# EAGLE schematic GPS Tracker v1.2 (EAGLE 6.4)
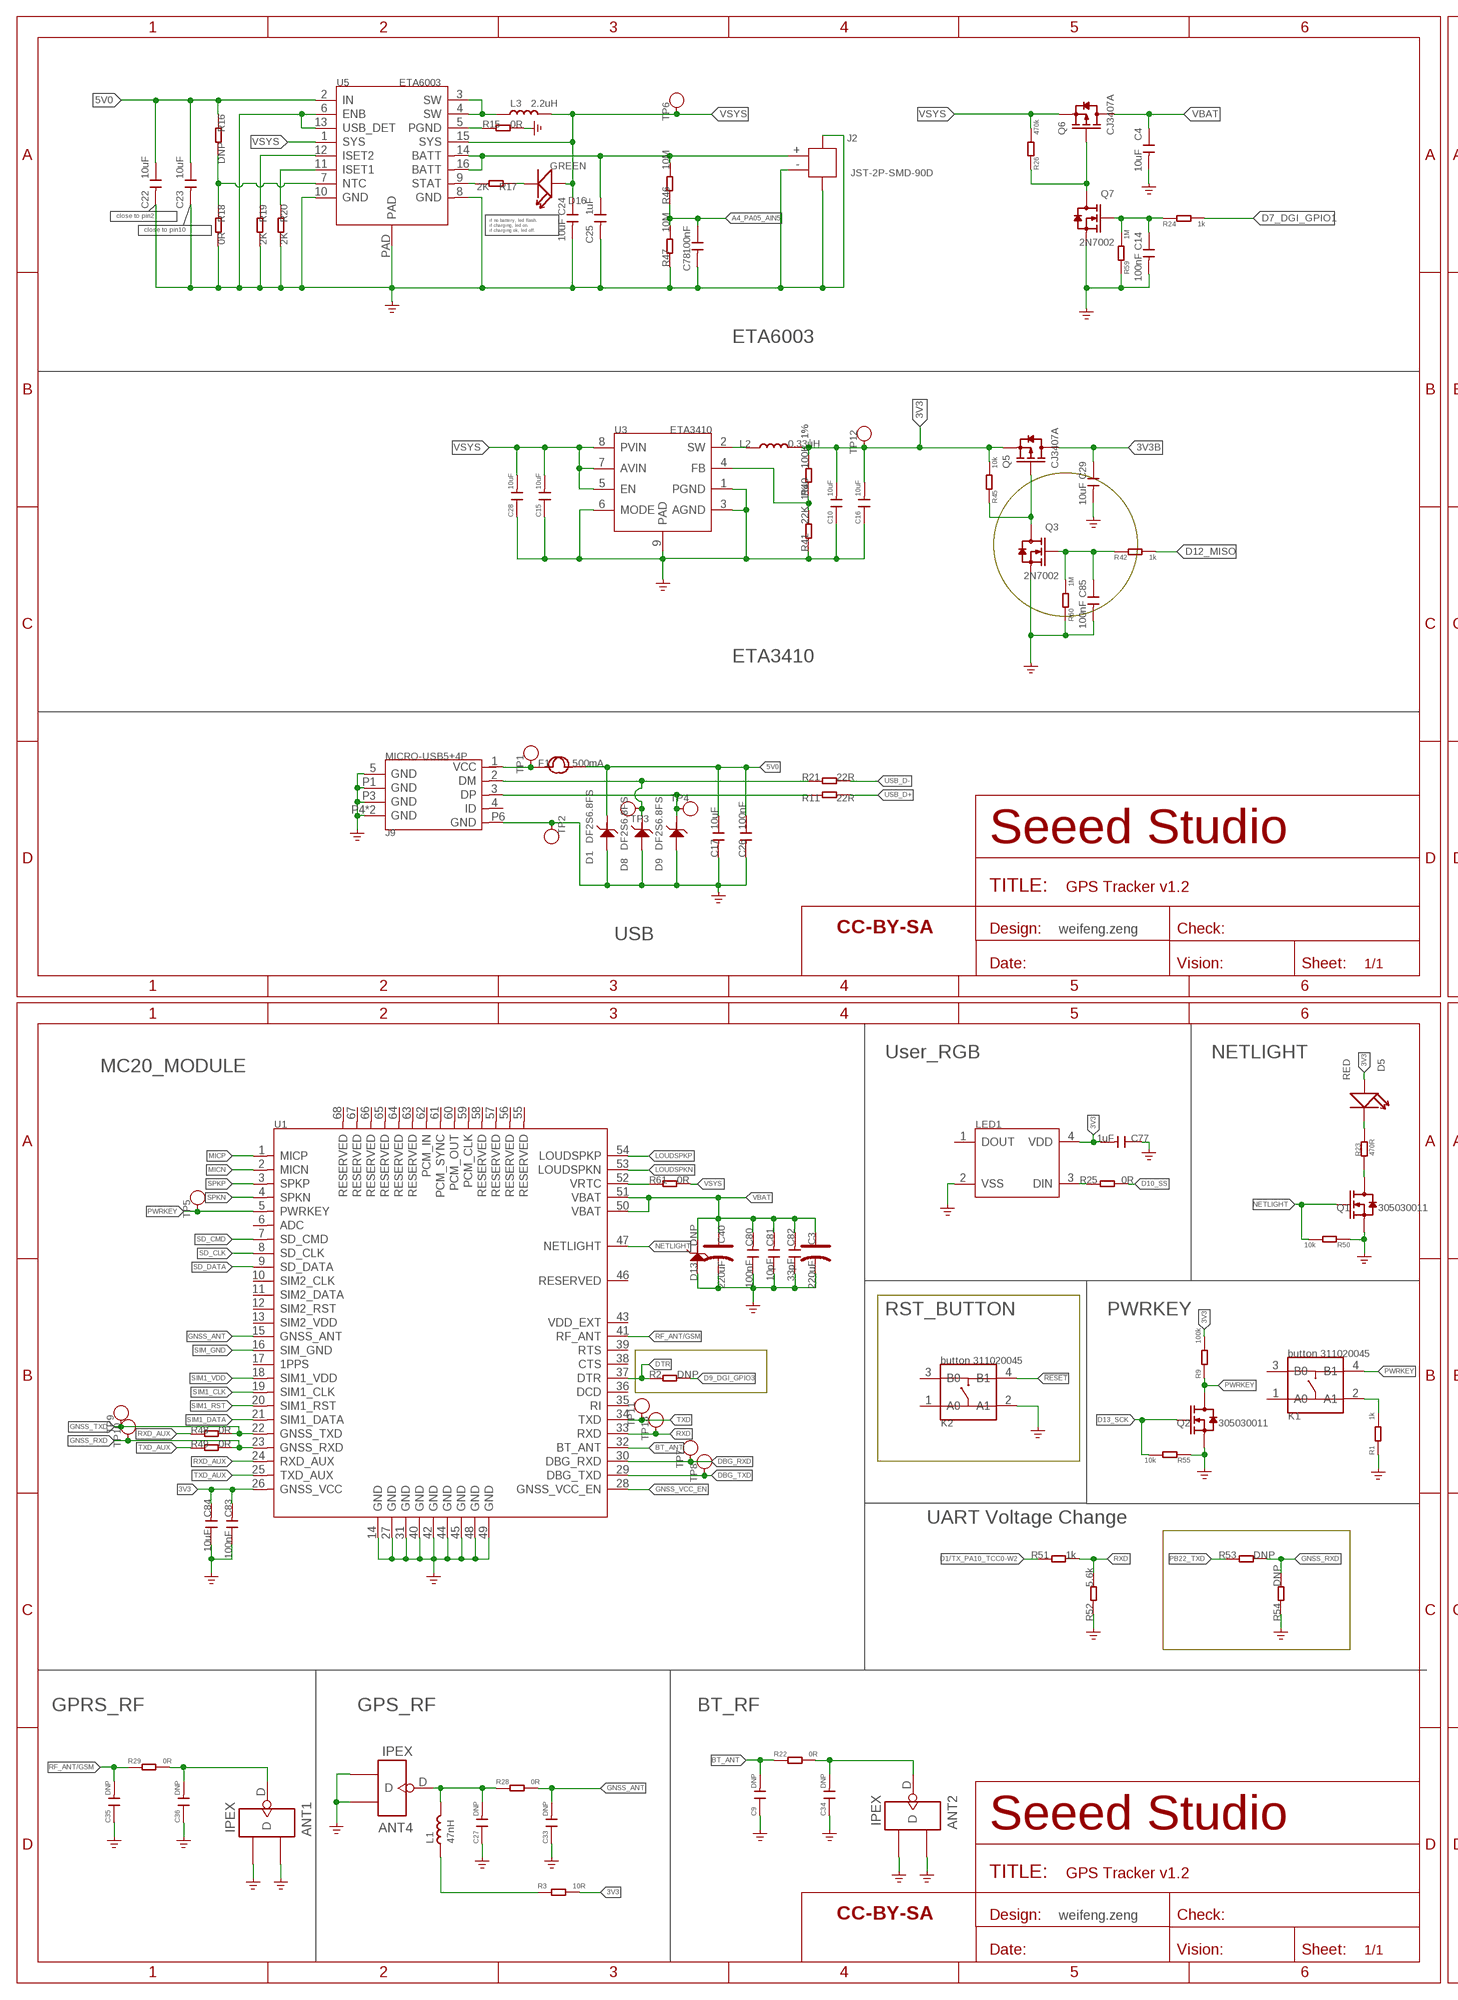
[diagram p0: schematic, sheet 1, part 1 of 2]
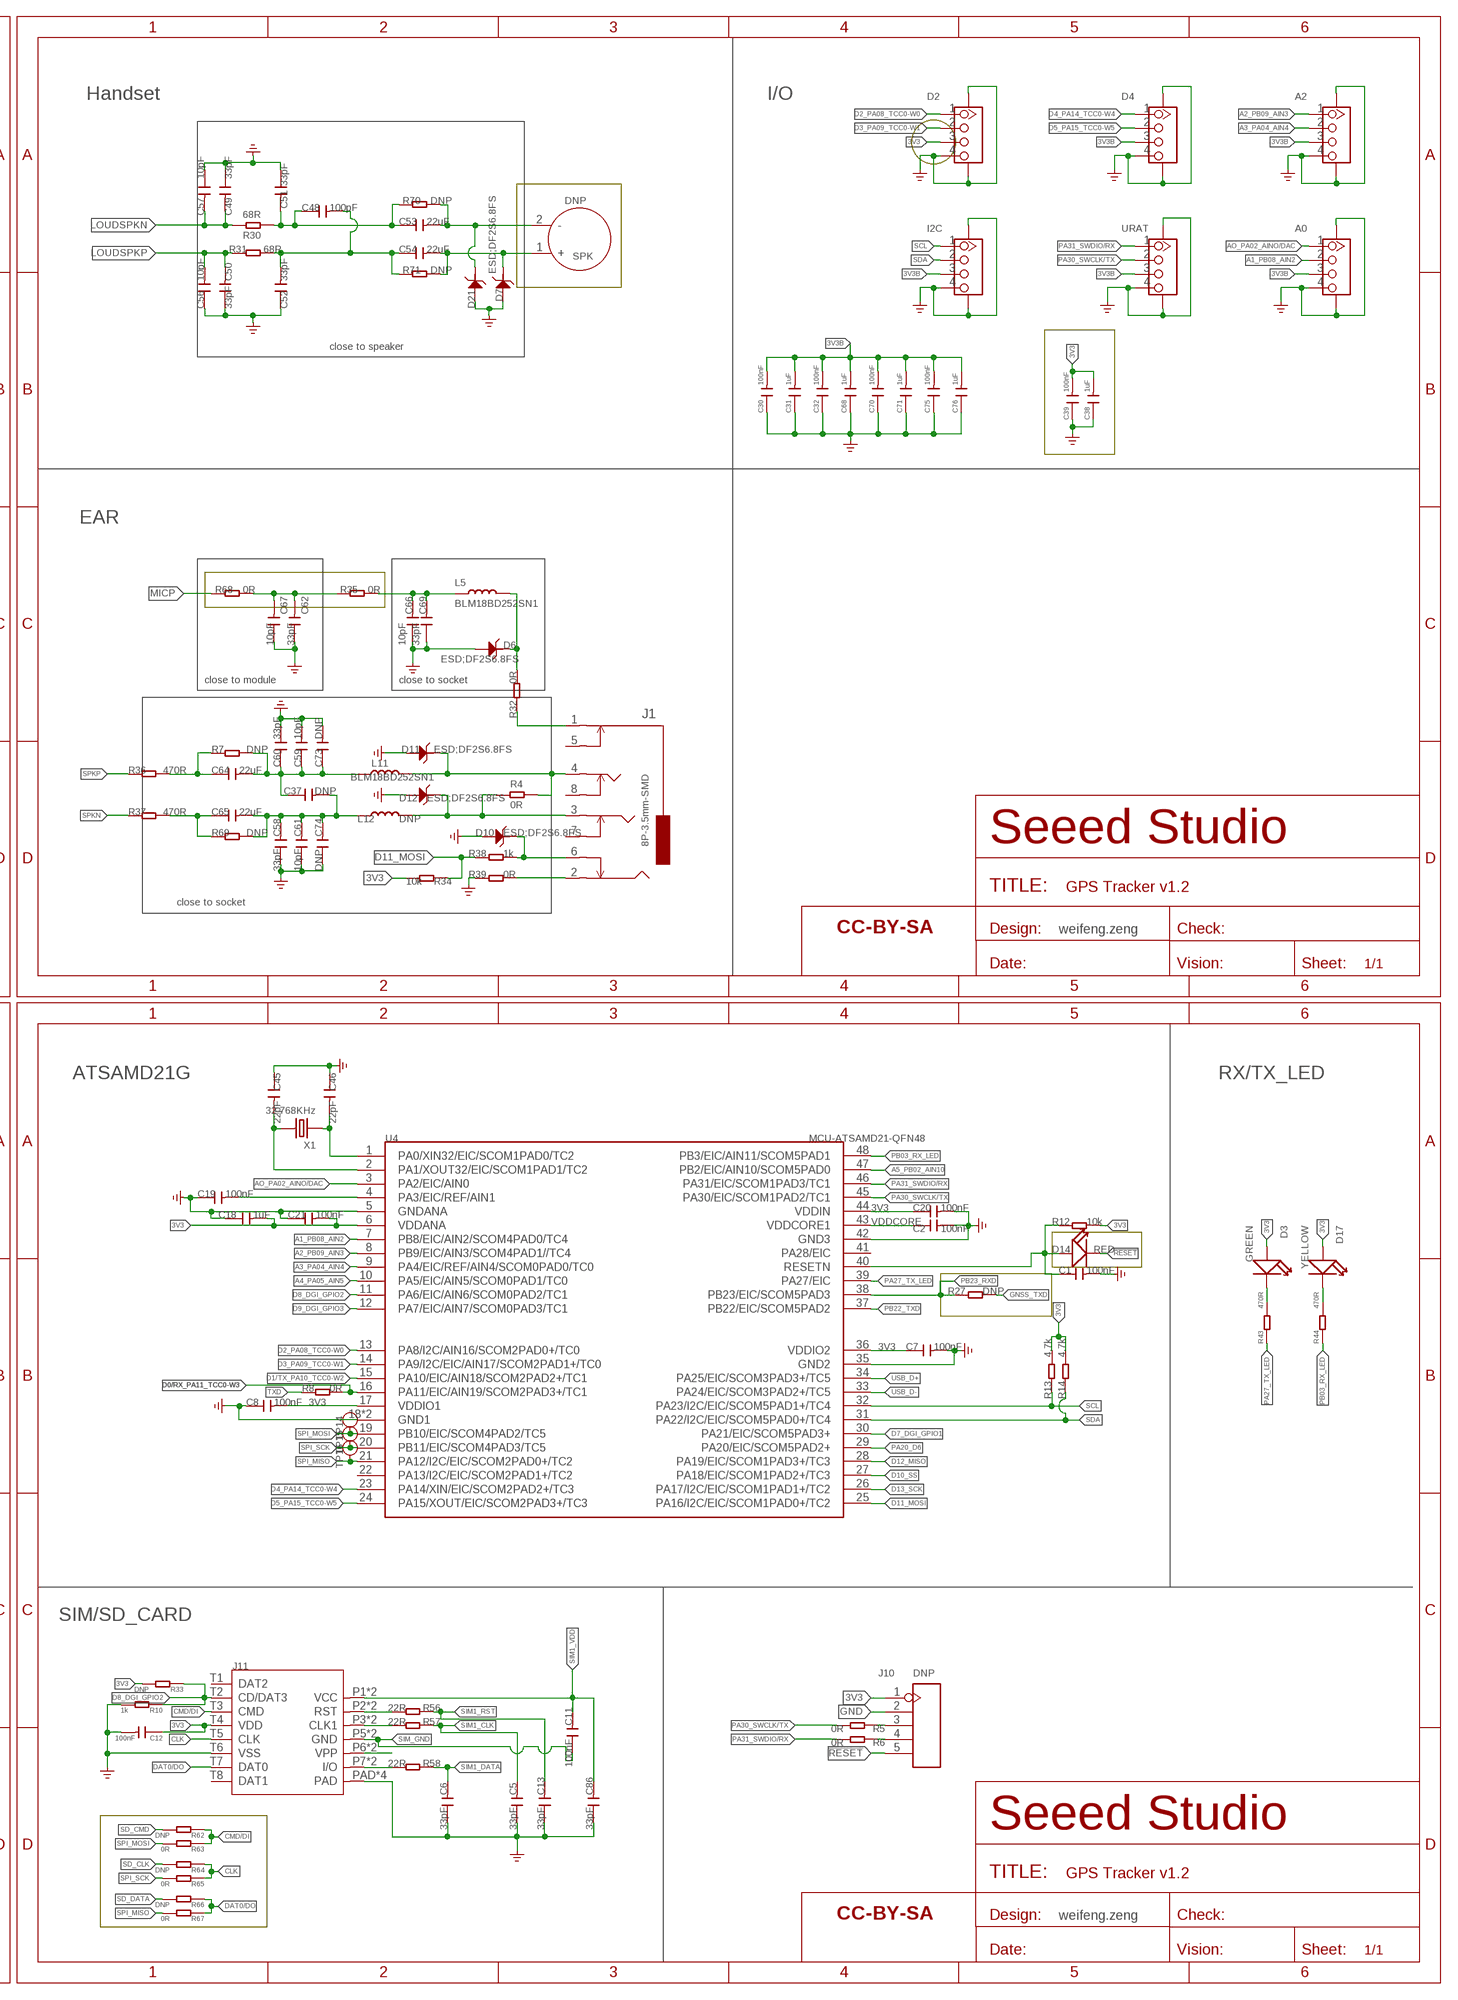
[diagram p1: schematic, sheet 1, part 2 of 2]

## Parts
A0  GROVE-CONNECTOR-SMD'90D'  [HW4-SMD-2.0-90D]
A2  GROVE-CONNECTOR-SMD'90D'  [HW4-SMD-2.0-90D]
ANT1  IPEX  ANTENNA-U-FL  [U-FL3P-SMD-2.6X2.6X1.0MM]
ANT2  IPEX  ANTENNA-U-FL  [U-FL3P-SMD-2.6X2.6X1.0MM]
ANT4  IPEX  ANTENNA-U-FL  [U-FL3P-SMD-2.6X2.6X1.0MM]
C1  100nF  C-0402  [C0402]
C2  100nF  C-0402  [C0402]
C3  220uF  CAP-POLAR-AVX-B  [AVX-B]
C4  10uF  C-0603  [C0603]
C5  33pF  C-0402  [C0402]
C6  33pF  C-0402  [C0402]
C7  100nF  C-0402  [C0402]
C8  100nF  C-0402  [C0402]
C9  DNP  C-0402  [C0402]
C10  10uF  C-0603  [C0603]
C11  100nF  C-0402  [C0402]
C12  100nF  C-0402  [C0402]
C13  33pF  C-0402  [C0402]
C14  100nF  C-0603  [C0603]
C15  10uF  C-0603  [C0603]
C16  10uF  C-0603  [C0603]
C17  10uF  C-0603  [C0603]
C18  1uF  C-0402  [C0402]
C19  100nF  C-0402  [C0402]
C20  100nF  C-0402  [C0402]
C21  100nF  C-0402  [C0402]
C22  10uF  C-0603  [C0603]
C23  10uF  C-0603  [C0603]
C24  10uF  C-0603  [C0603]
C25  1uF  C-0402  [C0402]
C26  100nF  C-0402  [C0402]
C27  DNP  C-0402  [C0402]
C28  10uF  C-0603  [C0603]
C29  10uF  C-0603  [C0603]
C30  100nF  C-0402  [C0402]
C31  1uF  C-0402  [C0402]
C32  100nF  C-0402  [C0402]
C33  DNP  C-0402  [C0402]
C34  DNP  C-0402  [C0402]
C35  DNP  C-0402  [C0402]
C36  DNP  C-0402  [C0402]
C37  DNP  C-0402  [C0402]
C38  1uF  C-0402  [C0402]
C39  100nF  C-0402  [C0402]
C40  220uF  CAP-POLAR-AVX-B  [AVX-B]
C45  22pF  C-0402  [C0402]
C46  22pF  C-0402  [C0402]
C48  100pF  C-0402  [C0402]
C49  33pF  C-0402  [C0402]
C50  33pF  C-0402  [C0402]
C51  33pF  C-0402  [C0402]
C52  33pF  C-0402  [C0402]
C53  22uF  CAP-0805  [C0805]
C54  22uF  CAP-0805  [C0805]
C56  10pF  C-0402  [C0402]
C57  10pF  C-0402  [C0402]
C58  33pF  C-0402  [C0402]
C59  10pF  C-0402  [C0402]
C60  33pF  C-0402  [C0402]
C61  10pF  C-0402  [C0402]
C62  33pF  C-0402  [C0402]
C64  22uF  CAP-0805  [C0805]
C65  22uF  CAP-0805  [C0805]
C66  10pF  C-0402  [C0402]
C67  10pF  C-0402  [C0402]
C68  1uF  C-0402  [C0402]
C69  33pF  C-0402  [C0402]
C70  100nF  C-0402  [C0402]
C71  1uF  C-0402  [C0402]
C73  DNP  C-0402  [C0402]
C74  DNP  C-0402  [C0402]
C75  100nF  C-0402  [C0402]
C76  1uF  C-0402  [C0402]
C77  1uF  C-0402  [C0402]
C78  100nF  C-0402  [C0402]
C80  100nF  C-0402  [C0402]
C81  10pF  C-0402  [C0402]
C82  33pF  C-0402  [C0402]
C83  100nF  C-0402  [C0402]
C84  10uF  C-0603  [C0603]
C85  100nF  C-0603  [C0603]
C86  33pF  C-0402  [C0402]
D1  DF2S6.8FS  D-ESD-2P'DF2S6.8FS'  [SOD-923]
D2  GROVE-CONNECTOR-SMD'90D'  [HW4-SMD-2.0-90D]
D3  GREEN  LED-0402  [LED-0402]
D4  GROVE-CONNECTOR-SMD'90D'  [HW4-SMD-2.0-90D]
D5  RED  LED-0402  [LED-0402]
D6  ESD;DF2S6.8FS  D-ESD-2P'DF2S6.8FS'  [SOD-923]
D7  ESD;DF2S6.8FS  D-ESD-2P'DF2S6.8FS'  [SOD-923]
D8  DF2S6.8FS  D-ESD-2P'DF2S6.8FS'  [SOD-923]
D9  DF2S6.8FS  D-ESD-2P'DF2S6.8FS'  [SOD-923]
D10  ESD;DF2S6.8FS  D-ESD-2P'DF2S6.8FS'  [SOD-923]
D11  ESD;DF2S6.8FS  D-ESD-2P'DF2S6.8FS'  [SOD-923]
D12  ESD;DF2S6.8FS  D-ESD-2P'DF2S6.8FS'  [SOD-923]
D13  DNP  D-ESD-2P'DF2S6.8FS'  [SOD-923]
D14  RED  LED-0402  [LED-0402]
D16  GREEN  LED-0402  [LED-0402]
D17  YELLOW  LED-0402  [LED-0402]
D21  ESD;DF2S6.8FS  D-ESD-2P'DF2S6.8FS'  [SOD-923]
F1  500mA  FUSE'1206'  [F1206]
FR1  SEEEDSTUDIO-OPEN-SCH-FRAME  [SEEEDSTUDIO-PCB-FRAME]
FR2  SEEEDSTUDIO-OPEN-SCH-FRAME  [SEEEDSTUDIO-PCB-FRAME]
FR3  SEEEDSTUDIO-OPEN-SCH-FRAME  [SEEEDSTUDIO-PCB-FRAME]
FR4  SEEEDSTUDIO-OPEN-SCH-FRAME  [SEEEDSTUDIO-PCB-FRAME]
I2C  GROVE-CONNECTOR-SMD'90D'  [HW4-SMD-2.0-90D]
J1  8P-3.5mm-SMD  AUDIO-8P'PJ-3536-L6S'  [8P-3.5-SMD]
J2  JST-2P-SMD-90D  JST-2P-SMD'1.0'  [HW2-SMD-1.0-90D]
J9  MICRO-USB5+4P  [MICRO-USB5+5P-SMD-0.65-7.2X5.06MM]
J10  DNP  HEADER-5P-TEST  [H5-SMD-2.0-TEST]
J11  NANO_SIM+TF-24P  [SIM+TF-24P-SMD-1.2-15.05X13.66X2.5MM]
K1  button 311020045  BUTTON-4P-4.5X3.2  [SW4P-SMD-4.5X3.2X2.5MM]
K2  button 311020045  BUTTON-4P-4.5X3.2  [SW4P-SMD-4.5X3.2X2.5MM]
L1  47nH  INDUCTOR/FERRITE-BEAD'0402'  [L0402]
L2  0.33uH  L-MPM201610SR33_T  [L201610]
L3  2.2uH  INDUCTOR/FERRITE-BEAD'0805'  [L0805]
L5  BLM18BD252SN1  L'0603'  [L0603]
L11  BLM18BD252SN1  L'0603'  [L0603]
L12  DNP  L'0603'  [L0603]
LED1  LED-RGB-4P-SK6812-SK6812  [LED4-1.75-3.7X3.5X0.95MM]
Q1  305030011  MOSFET-N+'SI1304BDL'  [SOT-323]
Q2  305030011  MOSFET-N+'SI1304BDL'  [SOT-323]
Q3  2N7002  MOSFET-N+'SOT23'  [SOT-23]
Q5  CJ3407A  MOSFET-P'SI2323CDS/SI2305DS<BR>'  [SOT-23]
Q6  CJ3407A  MOSFET-P'SI2323CDS/SI2305DS<BR>'  [SOT-23]
Q7  2N7002  MOSFET-N+'SOT23'  [SOT-23]
R1  1k  R-0402  [R0402]
R2  DNP  R-0402  [R0402]
R3  10R  R-0402  [R0402]
R4  0R  R-0402  [R0402]
R5  0R  R-0402  [R0402]
R6  0R  R-0402  [R0402]
R7  DNP  R-0402  [R0402]
R8  0R  R-0402  [R0402]
R9  100k  R-0402  [R0402]
R10  1k  R-0402  [R0402]
R11  22R  R-0402  [R0402]
R12  10k  R-0402  [R0402]
R13  4.7k  R-0402  [R0402]
R14  4.7k  R-0402  [R0402]
R15  0R  R-0402  [R0402]
R16  DNP  R-0402  [R0402]
R17  2K  R-0402  [R0402]
R18  0R  R-0402  [R0402]
R19  2K  R-0402  [R0402]
R20  2K  R-0402  [R0402]
R21  22R  R-0402  [R0402]
R22  0R  R-0402  [R0402]
R23  470R  R-0402  [R0402]
R24  1k  R-0402  [R0402]
R25  0R  R-0402  [R0402]
R26  470k  R-0402  [R0402]
R27  DNP  R-0402  [R0402]
R28  0R  R-0402  [R0402]
R29  0R  R-0402  [R0402]
R30  68R  R-0402  [R0402]
R31  68R  R-0402  [R0402]
R32  0R  R-0402  [R0402]
R33  DNP  R-0402  [R0402]
R34  10k  R-0402  [R0402]
R35  0R  R-0402  [R0402]
R36  470R  R-0402  [R0402]
R37  470R  R-0402  [R0402]
R38  1k  R-0402  [R0402]
R39  0R  R-0402  [R0402]
R40  100K_1%  R-0402  [R0402]
R41  22K_1%  R-0402  [R0402]
R42  1k  R-0402  [R0402]
R43  470R  R-0402  [R0402]
R44  470R  R-0402  [R0402]
R45  10k  R-0402  [R0402]
R46  10M  R-0402  [R0402]
R47  10M  R-0402  [R0402]
R48  0R  R-0402  [R0402]
R49  0R  R-0402  [R0402]
R50  10k  R-0402  [R0402]
R51  1k  R-0402  [R0402]
R52  5.6k  R-0402  [R0402]
R53  DNP  R-0402  [R0402]
R54  DNP  R-0402  [R0402]
R55  10k  R-0402  [R0402]
R56  22R  R-0402  [R0402]
R57  22R  R-0402  [R0402]
R58  22R  R-0402  [R0402]
R59  1M  R-0402  [R0402]
R60  1M  R-0402  [R0402]
R61  0R  R-0603  [R0603]
R62  DNP  R-0402  [R0402]
R63  0R  R-0402  [R0402]
R64  DNP  R-0402  [R0402]
R65  0R  R-0402  [R0402]
R66  DNP  R-0402  [R0402]
R67  0R  R-0402  [R0402]
R68  0R  R-0402  [R0402]
R69  DNP  R-0402  [R0402]
R70  DNP  R-0402  [R0402]
R71  DNP  R-0402  [R0402]
SPK  DNP  SPEAKER  [2P-SMD-SPEAKER]
TP1  TEST-POINT'4545'  [TP-D45MIL]
TP2  TEST-POINT'4545'  [TP-D45MIL]
TP3  TEST-POINT'4545'  [TP-D45MIL]
TP4  TEST-POINT'4545'  [TP-D45MIL]
TP5  TEST-POINT'4545'  [TP-D45MIL]
TP6  TEST-POINT'4545'  [TP-D45MIL]
TP7  TEST-POINT'4545'  [TP-D45MIL]
TP8  TEST-POINT'4545'  [TP-D45MIL]
TP9  TEST-POINT'4545'  [TP-D45MIL]
TP10  TEST-POINT'4545'  [TP-D45MIL]
TP11  TEST-POINT'4545'  [TP-D45MIL]
TP12  TEST-POINT'4545'  [TP-D45MIL]
TP13  TEST-POINT'4545'  [TP-D45MIL]
TP14  TEST-POINT'4545'  [TP-D45MIL]
TP15  TEST-POINT'4545'  [TP-D45MIL]
TP16  TEST-POINT'4545'  [TP-D45MIL]
U1  MODULE-MC20  [MODULE68P-SMD-1.0-18.7X16X2.1MM]
U3  ETA3410  CONVERTER-ETA3410  [DFN8G-0.5-2X2MM]
U4  MCU-ATSAMD21-QFN48  [QFN48-7X7]
U5  ETA6003  PMIC-ETA6003  [QFN16G-0.5-3X3MM@1]
URAT  GROVE-CONNECTOR-SMD'90D'  [HW4-SMD-2.0-90D]
X1  32.768KHz  CRYSTAL-2P'NX2012SA'  [X2-SMD-L2.0X1.2X0.55MM]

## Nets
3V3: C7.1 C8.2 C10.2 C12.1 C16.2 C18.2 C20.1 C21.2 C38.2 C39.2 C77.2 C83.2 C84.2 D2.3 D3.+ D5.+ D17.+ J10.1 J11.T4(VDD) L2.2 LED1.4(VDD) Q5.2(S) R3.2 R9.2 R12.1 R13.2 R14.2 R33.2 R34.1 R40.2 R45.2 TP12.T U1.26(GNSS_VCC) U4.6(VDDANA) U4.17(VDDIO1) U4.36(VDDIO2) U4.44(VDDIN)
3V3B: A0.3 A2.3 C29.1 C30.2 C31.2 C32.2 C68.2 C70.2 C71.2 C75.2 C76.2 D4.3 I2C.3 Q5.3(D) URAT.3
5V0: C17.1 C22.1 C23.1 C26.1 D1.1 F1.2 R16.1 U5.2(IN)
!RESET: D14.- J10.5 K2.4(B1)
A1_PB08_AIN2: A0.2 U4.7(PB8/EIC/AIN2/SCOM4PAD0/TC4)
A2_PB09_AIN3: A2.1 U4.8(PB9/EIC/AIN3/SCOM4PAD1//TC4)
A3_PA04_AIN4: A2.2 U4.9(PA4/EIC/REF/AIN4/SCOM0PAD0/TC0)
A4_PA05_AIN5: C78.1 R46.1 R47.2 U4.10(PA5/EIC/AIN5/SCOM0PAD1/TC0)
A5_PB02_AIN10: U4.47(PB2/EIC/AIN10/SCOM5PAD0)
AO_PA02_AINO/DAC: A0.1 U4.3(PA2/EIC/AIN0)
BT_ANT: C9.2 R22.1 U1.32(BT_ANT)
CLK: J11.T5(CLK) R64.1 R65.1
CMD/DI: J11.T3(CMD) R62.1 R63.1
D0/RX_PA11_TCC0-W3: R8.2 U4.16(PA11/EIC/AIN19/SCOM2PAD3+/TC1)
D1/TX_PA10_TCC0-W2: R51.1 U4.15(PA10/EIC/AIN18/SCOM2PAD2+/TC1)
D2_PA08_TCC0-W0: D2.1 U4.13(PA8/I2C/AIN16/SCOM2PAD0+/TC0)
D3_PA09_TCC0-W1: D2.2 U4.14(PA9/I2C/EIC/AIN17/SCOM2PAD1+/TC0)
D4_PA14_TCC0-W4: D4.1 U4.23(PA14/XIN/EIC/SCOM2PAD2+/TC3)
D5_PA15_TCC0-W5: D4.2 U4.24(PA15/XOUT/EIC/SCOM2PAD3+/TC3)
D7_DGI_GPIO1: R24.2 U4.30(PA21/EIC/SCOM5PAD3+)
D8_DGI_GPIO2: J11.T2(CD/DAT3) R10.1 R33.1 U4.11(PA6/EIC/AIN6/SCOM0PAD2/TC1)
D9_DGI_GPIO3: R2.2 U4.12(PA7/EIC/AIN7/SCOM0PAD3/TC1)
D10_SS: R25.2 U4.27(PA18/EIC/SCOM1PAD2+/TC3)
D11_MOSI: R34.2 R38.1 U4.25(PA16/I2C/EIC/SCOM1PAD0+/TC2)
D12_MISO: R42.2 U4.28(PA19/EIC/SCOM1PAD3+/TC3)
D13_SCK: Q2.1(G) R55.2 U4.26(PA17/I2C/EIC/SCOM1PAD1+/TC2)
D-1: D8.1 J9.2(DM) R21.1 TP3.T
DAT0/DO: J11.T7(DAT0) R66.1 R67.1
DBG_RXD: TP7.T U1.30(DBG_RXD)
DBG_TXD: TP8.T U1.29(DBG_TXD)
DTR: R2.1 U1.37(DTR)
FM_N: D12.1 J1.3 L12.2 R4.1
FM_P: D11.1 J1.4 L11.2 R4.2
GND: A0.4 A0.SS1 A0.SS2 A2.4 A2.SS1 A2.SS2 ANT1.GND1 ANT1.GND2 ANT2.GND1 ANT2.GND2 ANT4.GND1 ANT4.GND2 C1.2 C2.2 C3.- C4.2 C5.1 C6.1 C7.2 C8.1 C9.1 C10.1 C12.2 C13.1 C14.2 C15.1 C16.1 C17.2 C18.1 C19.1 C20.2 C21.1 C22.2 C23.2 C24.2 C25.2 C26.2 C27.1 C28.1 C29.2 C30.1 C31.1 C32.1 C33.1 C34.1 C35.1 C36.1 C38.1 C39.1 C40.- C45.1 C46.1 C49.1 C50.1 C51.1 C52.1 C56.1 C57.1 C58.1 C59.2 C60.1 C61.1 C62.1 C66.1 C67.1 C68.1 C69.1 C70.1 C71.1 C73.2 C74.1 C75.1 C76.1 C77.1 C78.2 C80.1 C81.1 C82.1 C83.1 C84.1 C85.2 C86.1 D1.2 D2.4 D2.SS1 D2.SS2 D4.4 D4.SS1 D4.SS2 D6.2 D7.2 D8.2 D9.2 D10.2 D11.2 D12.2 D13.2 D21.2 I2C.4 I2C.SS1 I2C.SS2 J2.3 J2.4 J2.- J9.5(GND) J9.P1(GND) J9.P3(GND) J9.P4(GND) J9.P5(GND) J9.P6(GND) J10.2 J11.PAD J11.PAD1(PAD) J11.PAD2(PAD) J11.PAD3(PAD) J11.T6(VSS) K2.2(A1) LED1.2(VSS) Q1.2(S) Q2.2(S) Q3.2(S) Q7.2(S) R1.1 R10.2 R15.2 R18.2 R19.2 R20.2 R39.1 R41.1 R47.1 R50.1 R52.1 R54.1 R55.1 R59.1 R60.1 TP2.T U1.14(GND) U1.27(GND) U1.31(GND) U1.40(GND) U1.42(GND) U1.44(GND) U1.45(GND) U1.48(GND) U1.49(GND) U3.1(PGND) U3.3(AGND) U3.6(MODE) U3.9(PAD) U4.5(GNDANA) U4.18(GND1) U4.35(GND2) U4.42(GND3) U4.PAD(GND1) U5.6(ENB) U5.8(GND) U5.10(GND) U5.13(USB_DET) U5.PAD URAT.4 URAT.SS1 URAT.SS2 ; supply symbol labelled GND_POWER
GNSS_ANT: C33.2 R28.2 U1.15(GNSS_ANT)
GNSS_RXD: R49.2 R53.2 R54.2 TP10.T U1.23(GNSS_RXD)
GNSS_TXD: R27.1 R48.2 TP9.T U1.22(GNSS_TXD)
GNSS_VCC_EN: U1.28(GNSS_VCC_EN)
LOUDSPKN: C49.2 C57.2 R30.1 U1.53(LOUDSPKN)
LOUDSPKP: C50.2 C56.2 R31.1 U1.54(LOUDSPKP)
MICN: U1.2(MICN)
MICP: R68.1 U1.1(MICP)
N$1: Q6.1(G) Q7.3(D) R26.1
N$2: LED1.3(DIN) R25.1
N$3: K1.2(A1) R1.2
N$4: L1.1 R3.1
N$5: C19.2 U4.4(PA3/EIC/REF/AIN1)
N$6: J1.1 R32.1
N$7: C14.1 Q7.1(G) R24.1 R59.2
N$8: C46.2 U4.1(PA0/XIN32/EIC/SCOM1PAD0/TC2) X1.1
N$9: ANT2.D C34.2 R22.2
N$10: R61.1 U1.52(VRTC)
N$11: C1.1 D14.+ R12.2 U4.40(RESETN)
N$13: ANT4.D C27.2 L1.2 R28.1
N$15: ANT1.D C36.2 R29.2
N$21: R40.1 R41.2 U3.4(FB)
N$22: C53.2 D21.1 R70.2 SPK.2(-)
N$23: Q1.3(D) R23.1
N$24: D5.- R23.2
N$26: L3.1 U5.3(SW) U5.4(SW)
N$27: Q3.3(D) Q5.1(G) R45.1
N$28: C25.1 J2.+ R46.2 U5.14(BATT) U5.16(BATT)
N$29: L2.1 U3.2(SW)
N$30: D16.- R17.1
N$31: R17.2 U5.9(STAT)
N$32: C54.2 D7.1 R71.2 SPK.1(+)
N$33: R16.2 R18.1 U5.7(NTC)
N$34: R20.1 U5.11(ISET1)
N$36: R19.1 U5.12(ISET2)
N$37: R15.1 U5.5(PGND)
N$38: C48.1 C51.2 C53.1 R30.2 R70.1
N$39: C48.2 C52.2 C54.1 R31.2 R71.1
N$40: D6.1 L5.2 R32.2
N$41: C62.2 C67.2 R35.1 R68.2
N$42: D9.1 J9.3(DP) R11.1 TP4.T
N$43: D10.1 J1.6 R38.2
N$44: J10.3 R5.1
N$45: J10.4 R6.1
N$46: C45.2 U4.2(PA1/XOUT32/EIC/SCOM1PAD1/TC2) X1.2
N$47: J1.2 R39.2
N$48: F1.1 J9.1(VCC) TP1.T
N$49: C66.2 C69.2 L5.1 R35.2
N$50: C37.2 C58.2 C61.2 C65.2 C74.2 L12.1 R69.2
N$51: C65.1 R37.2 R69.1
N$52: C64.1 R7.1 R36.2
N$53: C37.1 C59.1 C60.2 C64.2 C73.1 L11.1 R7.2
N$54: C85.1 Q3.1(G) R42.1 R60.2
N$55: D3.- R43.2
N$56: D17.- R44.2
N$60: J11.P2(RST) J11.P2B(RST) R56.2
N$61: J11.P3(CLK1) J11.P3B(CLK1) R57.2
N$63: J11.P6(VPP) J11.P6B(VPP)
N$64: J11.P7(I/O) J11.P7B(I/O) R58.2
NETLIGHT: Q1.1(G) R50.2 U1.47(NETLIGHT)
PA20_D6: U4.29(PA20/EIC/SCOM5PAD2+)
PA27_TX_LED: R43.1 U4.39(PA27/EIC)
PA30_SWCLK/TX: R5.2 U4.45(PA30/EIC/SCOM1PAD2/TC1) URAT.2
PA31_SWDIO/RX: R6.2 U4.46(PA31/EIC/SCOM1PAD3/TC1) URAT.1
PB03_RX_LED: R44.1 U4.48(PB3/EIC/AIN11/SCOM5PAD1)
PB22_TXD: R53.1 U4.37(PB22/EIC/SCOM5PAD2)
PB23_RXD: R27.2 U4.38(PB23/EIC/SCOM5PAD3)
PWRKEY: K1.4(B1) Q2.3(D) R9.1 TP5.T U1.5(PWRKEY)
RF_ANT/GSM: C35.2 R29.1 U1.41(RF_ANT)
RXD: R51.2 R52.2 TP13.T U1.33(RXD)
RXD_AUX: R48.1 U1.24(RXD_AUX)
SCL: I2C.1 R13.1 U4.32(PA23/I2C/EIC/SCOM5PAD1+/TC4)
SD_CLK: R64.2 U1.8(SD_CLK)
SD_CMD: R62.2 U1.7(SD_CMD)
SD_DATA: R66.2 U1.9(SD_DATA)
SDA: I2C.2 R14.1 U4.31(PA22/I2C/EIC/SCOM5PAD0+/TC4)
SIM1_CLK: C5.2 R57.1 U1.19(SIM1_CLK)
SIM1_DATA: C6.2 R58.1 U1.21(SIM1_DATA)
SIM1_RST: C13.2 R56.1 U1.20(SIM1_RST)
SIM1_VDD: C11.2 C86.2 J11.P1(VCC) J11.P1B(VCC) U1.18(SIM1_VDD)
SIM_GND: C11.1 J11.P5(GND) J11.P5B(GND) U1.16(SIM_GND)
SPI_MISO: R67.2 TP16.T U4.21(PA12/I2C/EIC/SCOM2PAD0+/TC2)
SPI_MOSI: R63.2 TP14.T U4.19(PB10/EIC/SCOM4PAD2/TC5)
SPI_SCK: R65.2 TP15.T U4.20(PB11/EIC/SCOM4PAD3/TC5)
SPKN: R37.1 U1.4(SPKN)
SPKP: R36.1 U1.3(SPKP)
TXD: R8.1 TP11.T U1.34(TXD)
TXD_AUX: R49.1 U1.25(TXD_AUX)
USB_D+: R11.2 U4.34(PA25/EIC/SCOM3PAD3+/TC5)
USB_D-: R21.2 U4.33(PA24/EIC/SCOM3PAD2+/TC5)
VBAT: C3.+ C4.1 C40.+ C80.2 C81.2 C82.2 D13.1 Q6.3(D) U1.50(VBAT) U1.51(VBAT)
VDDCORE: C2.1 U4.43(VDDCORE1)
VSYS: C15.2 C24.1 C28.2 D16.+ L3.2 Q6.2(S) R26.2 R61.2 TP6.T U3.5(EN) U3.7(AVIN) U3.8(PVIN) U5.1(SYS) U5.15(SYS)
Unconnected: J1.5 J1.7 J1.8 J9.4(ID) J11.T1(DAT2) J11.T8(DAT1) K1.1(A0) K1.3(B0) K2.1(A0) K2.3(B0) LED1.1(DOUT) U1.6(ADC) U1.10(SIM2_CLK) U1.11(SIM2_DATA) U1.12(SIM2_RST) U1.13(SIM2_VDD) U1.17(1PPS) U1.35(RI) U1.36(DCD) U1.38(CTS) U1.39(RTS) U1.43(VDD_EXT) U1.46(RESERVED) U1.55(RESERVED) U1.56(RESERVED) U1.57(RESERVED) U1.58(RESERVED) U1.59(PCM_CLK) U1.60(PCM_OUT) U1.61(PCM_SYNC) U1.62(PCM_IN) U1.63(RESERVED) U1.64(RESERVED) U1.65(RESERVED) U1.66(RESERVED) U1.67(RESERVED) U1.68(RESERVED) U4.22(PA13/I2C/EIC/SCOM2PAD1+/TC2) U4.41(PA28/EIC)

## Notes on the sheet
- Handset | I/O
- close to pin2
- close to pin10
- if no battery, led flash.
  if charging, led on.
  if charging ok, led off.
- ETA6003
- close to speaker
- EAR
- ETA3410
- close to module | close to socket
- close to socket
- weifeng.zeng | weifeng.zeng
- USB
- User_RGB | NETLIGHT
- MC20_MODULE
- ATSAMD21G | RX/TX_LED
- RST_BUTTON | PWRKEY
- UART Voltage Change
- SIM/SD_CARD
- GPRS_RF | GPS_RF | BT_RF
- weifeng.zeng | weifeng.zeng

## Library data of the parts
A0 A2 D2 D4 I2C URAT = Connector-new:GROVE-CONNECTOR-SMD: 4P-SMD-2.0:320110030;4P-SMD-2.0-90D:320110032
ANT1 ANT2 ANT4 = Connector-new:ANTENNA-U-FL: 320110048
C1 C2 C4-C39 C45 C46 C48-C52 C56-C62 C66-C71 C73-C78 C80-C86 = Discrete-small:C*: Ceramic Capacitors
C3 C40 = Discrete-new:CAP-POLAR: Electrolytic Capacitors,Tantalum Capacitors and Super Capacitors
C53 C54 C64 C65 = Discrete-new:CAP: Ceramic Capacitors
D1 D6-D13 D21 = Discrete-new:D-ESD-2P: SOD-923:304060009;SOD-123:304060001
D3 D5 D14 D16 D17 = Discrete-new:LED
F1 = Discrete-new:FUSE
FR1-FR4 = moudle-new:SEEEDSTUDIO-OPEN-SCH-FRAME
J1 = template:AUDIO-8P
J2 = Connector-new:JST-2P-SMD: 2P-SMD-1.0-90D:320110054;2P-SMD-2.0-90D:320110026
J9 = Connector-new:MICRO-USB5+4P: 5+4P-SMD-0.65-B:320010000;5+2P-SMD-0.65-AB:340032001;5+5P-SMD-0.65-7.2X5.06MM:320010050;
J10 = Connector-new:HEADER-5P
J11 = Connector-new:NANO_SIM+TF-24P
K1 K2 = Discrete-new:BUTTON-4P: SW4-6.0X6.0X5.0MM:311020024;SW4-8.0X8.0X9.0MM:311020028;SW4-SMD-6.0X6.0X5.0MM:311020004;SW4-SMD-3.35X3.35X1.5MM:311020030;SW4-SMD-5.2X5.2X2.5MM:311020046
L1 L3 = Discrete-new:INDUCTOR/FERRITE-BEAD
L2 = Discrete-new:L
L5 L11 L12 = Discrete:L*
LED1 = Discrete-new:LED-RGB-4P-SK6812
Q1-Q3 Q7 = Discrete-new:MOSFET-N+: IRLL014: http://www.vishay.com/docs/91319/sihll014.pdf
Q5 Q6 = Discrete-new:MOSFET-P
R1-R71 = Discrete-small:R*
SPK = template:SPEAKER
TP1-TP16 = Discrete-new:TEST-POINT; PARTNO: DNP
U1 = moudle-new:MODULE-MC20
U3 = IC-new:CONVERTER-ETA3410: 3MHZ 2A High Step-Down Converter in DFN2x2-8L Package
U4 = IC-new:MCU-ATSAMD21: Atmel D21 32bit ARM Cortex-M0 microcontroller - 48 PIN TQFP 256KB flash memory + 32KB SRAM
U5 = template:PMIC-ETA6003: 2.5A,3MHZ Switching Charger with Dynamic Power Path Management
X1 = Discrete-new:CRYSTAL-2P